# EAGLE design control (EAGLE 9.6.2)
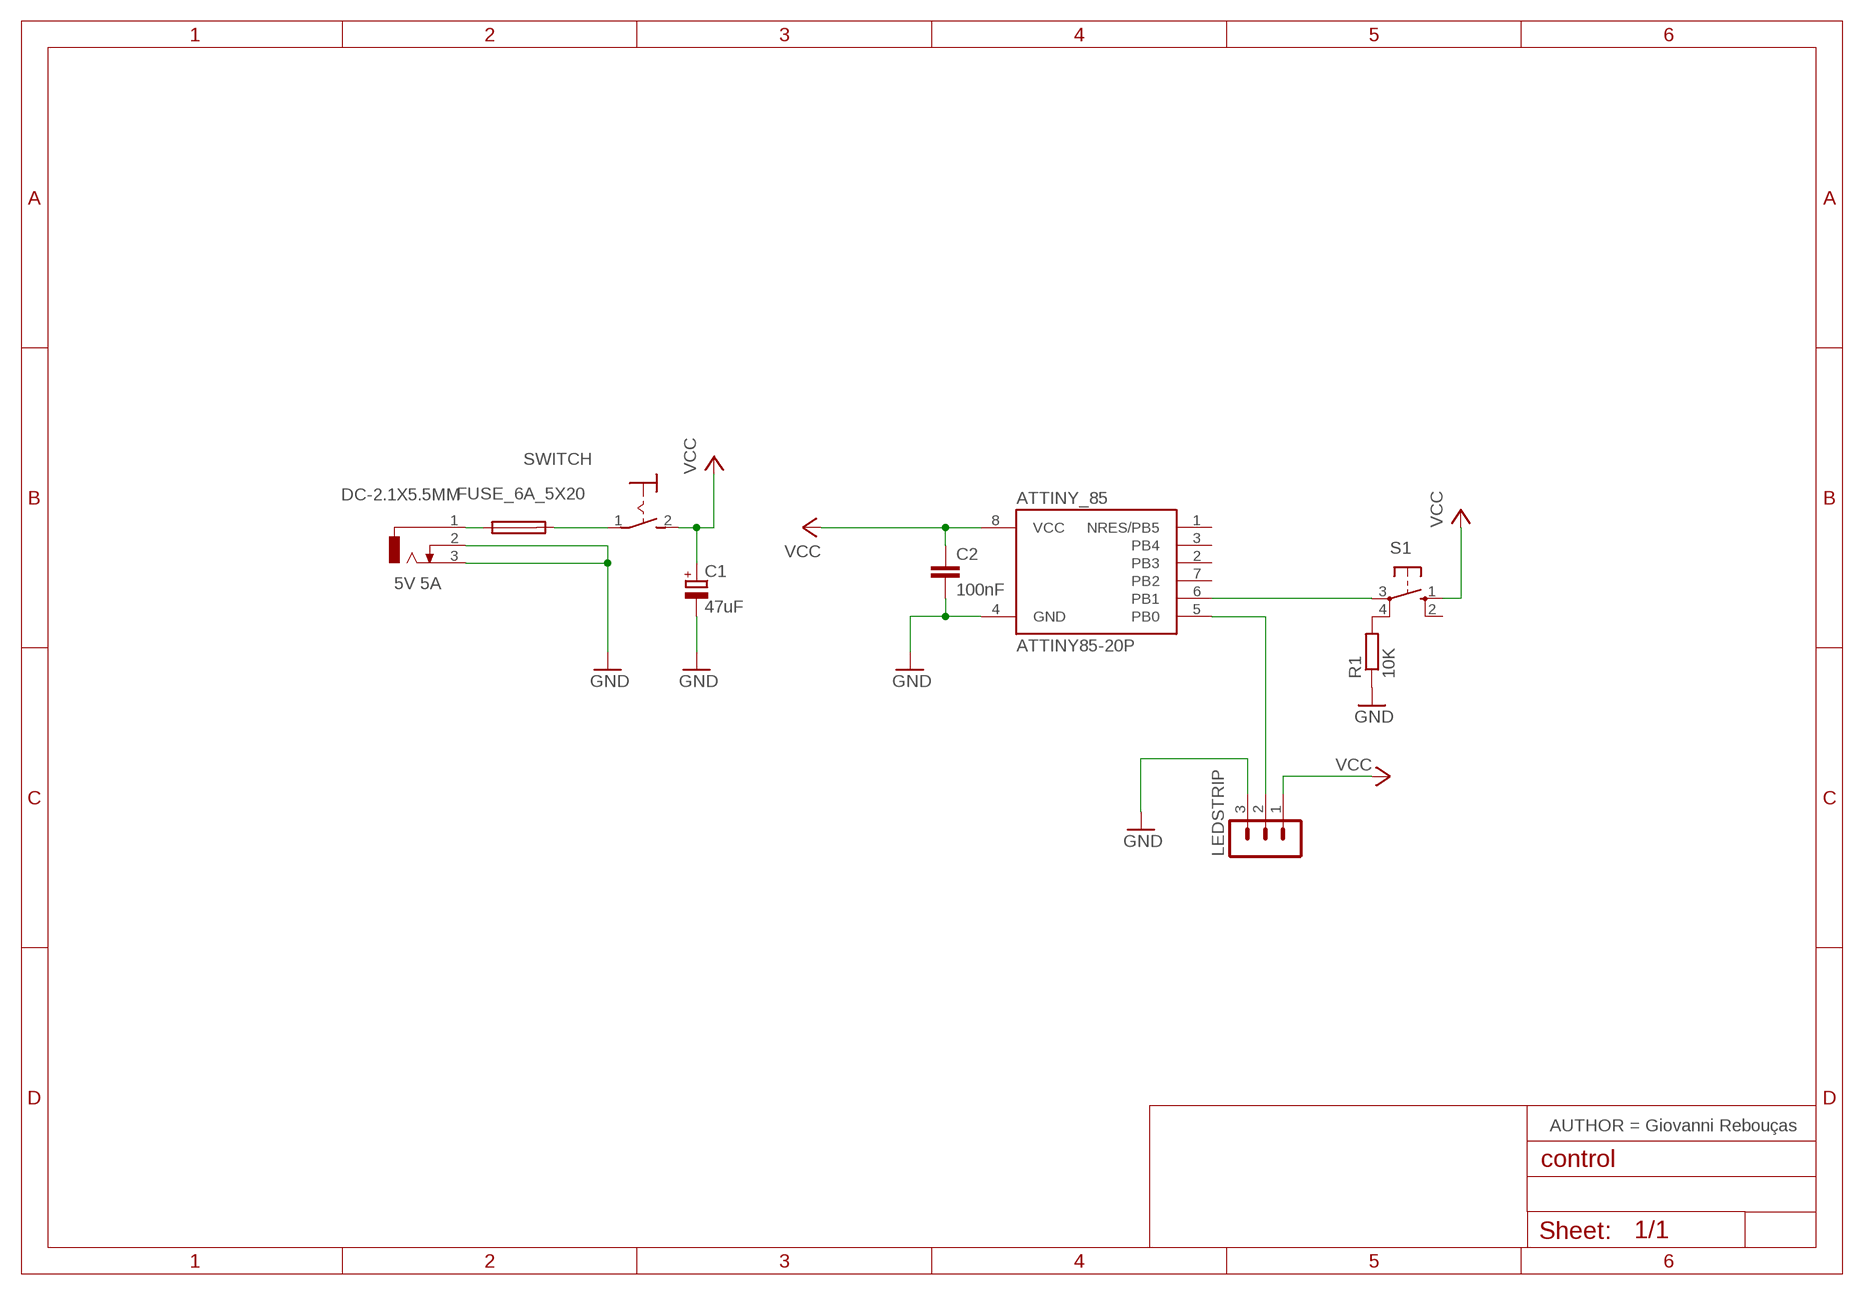
[diagram p0: schematic, sheet 1]
FRAME1 (A4L-LOC): AUTHOR: Giovanni Rebouças

## Parts
ATTINY_85  ATTINY85-20P  [PDIP08_300MIL]
C1  47uF  CPOL-EUE3.5-10  [E3,5-10]
C2  100nF  C-EU025-025X050  [C025-025X050]
DC-2.1X5.5MM  5V 5A  DCJ0303  [DCJ0303]
FUSE_6A_5X20  FUSEBLANK_5X20MM  [FUSE_HOLDER_5X20MM]
LEDSTRIP  MA03-1  [MA03-1]
R1  10K  R-EU_0207/10  [0207/10]
S1  10-XX  [B3F-10XX]
SWITCH  MS243  [MS243]

## Nets
DATAIN: ATTINY_85.5(PB0) LEDSTRIP.2
GND: ATTINY_85.4(GND) C1.- C2.2 DC-2.1X5.5MM.2 DC-2.1X5.5MM.3 LEDSTRIP.3 R1.1
N$3: R1.2 S1.4(P1)
N$4: DC-2.1X5.5MM.1 FUSE_6A_5X20.1
N$5: FUSE_6A_5X20.2 SWITCH.1(P)
SWITCHIN: ATTINY_85.6(PB1) S1.3(P)
VCC: ATTINY_85.8(VCC) C1.+ C2.1 LEDSTRIP.1 S1.1(S) SWITCH.2(S)
Unconnected: ATTINY_85.1(NRES/PB5) ATTINY_85.2(PB3) ATTINY_85.3(PB4) ATTINY_85.7(PB2) S1.2(S1)

## Library data of the parts
ATTINY_85 = _hhn_attiny25_45_85:ATTINY85*: ATMEL ATtiny 85 Packages: P = PDIP 08 30mil S = SOIC 08 EIAJ 208mil Technologies Note: for complete ordering code (temp. range, finish, tape&reel etc.) see www.atmel.com • Supply Voltage: V = (1.8…5.5)V | [blank] = (2.7…5.5)V • Speed: 10 = 10 MHz | 20 = 20 MHz Author: Dipl.-Ing. FH Rainer Bayer HHN Hochschule Heilbronn (Heilbronn University), rainer.bayer@hs-heilbronn.de Ingenieurbüro ing-rb, mail@ing-rb.de
C1 = rcl:CPOL-EU: POLARIZED CAPACITOR, European symbol; SPICEPREFIX: C
C2 = rcl:C-EU: CAPACITOR, European symbol; SPICEPREFIX: C
DC-2.1X5.5MM = con-jack:DCJ0303: DC POWER JACK Source: DCJ0303.pdf; OC_FARNELL: unknown; OC_NEWARK: unknown
FUSE_6A_5X20 = fuse:FUSE: Fuse; OC_FARNELL: unknown; OC_NEWARK: unknown
LEDSTRIP = con-lstb:MA03-1: PIN HEADER; OC_FARNELL: unknown; OC_NEWARK: unknown
R1 = rcl:R-EU_: RESISTOR, European symbol; SPICEPREFIX: R
S1 = switch-omron:10-XX: OMRON SWITCH; MPN: B3F-1000; OC_FARNELL: 176432; OC_NEWARK: 36M3542
SWITCH = fixed-switch:MS243: TOGGLE SWITCH

## Board
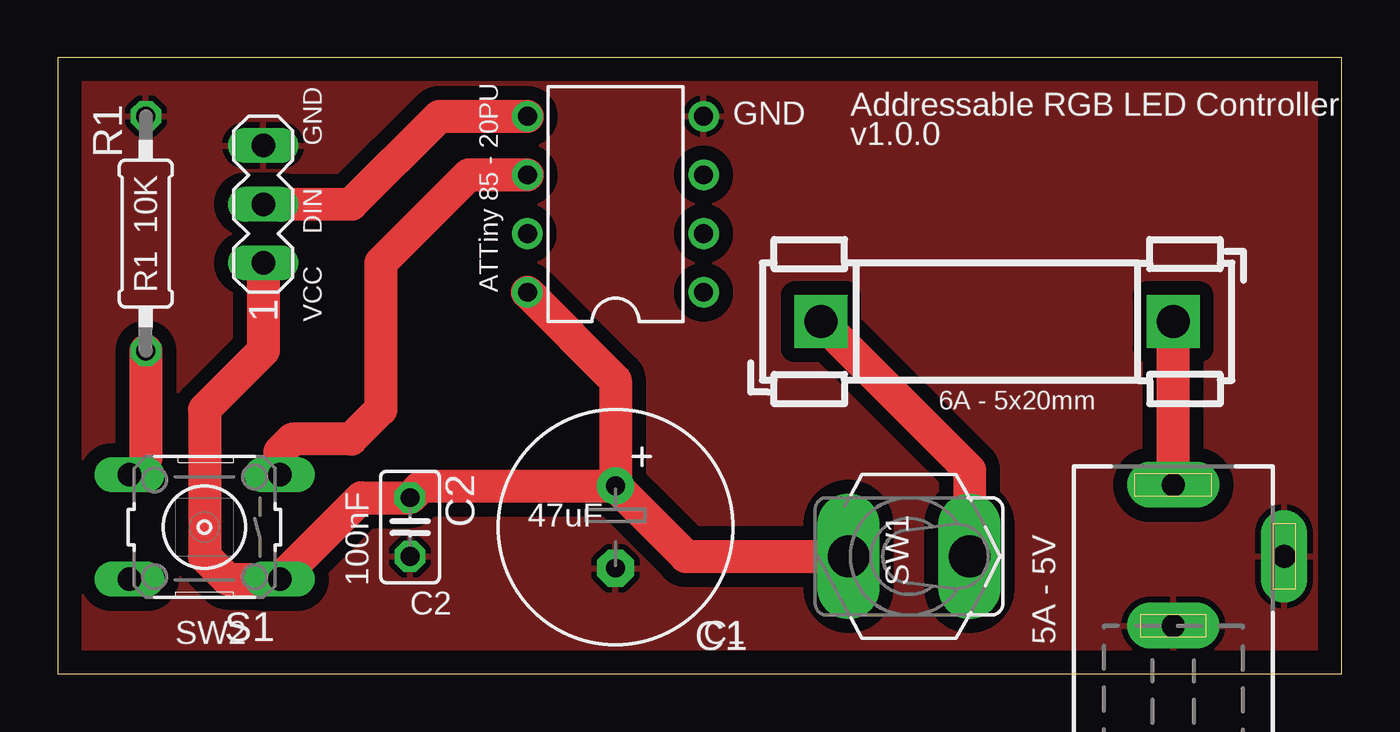
[diagram p1: board, top side]

Size 55.55 x 26.66 mm. Coordinates in mm from the lower left corner, seen from the top.
Outline: 0,0 55.55,0 55.55,26.66 0,26.66 0,0
Copper layers (1*16): Top 0.035mm / dielectric 1.5mm / Bottom 0.035mm
Design rules "default *": minimum track width 6mil, minimum drill 0.35mm, track to track 24mil, track to pad 24mil, pad to pad 24mil, via to via 24mil, smd to smd 6mil, copper to edge 40mil, drill to drill 6mil, minimum pad ring 10mil, minimum via ring 8mil, stop-mask expansion 4mil, vias tented up to drill 0mil, thermal gap 10mil

### Footprints (pad centres in the part's own frame; a part is rotated, then mirrored left to right if it is on the bottom)
PDIP08_300MIL = drill 0.813: 1 -3.81,-3.81; 2 -1.27,-3.81; 3 1.27,-3.81; 4 3.81,-3.81; 5 3.81,3.81; 6 1.27,3.81; 7 -1.27,3.81; 8 -3.81,3.81
E3,5-10 = drill 0.813 pad 1.6: + -1.778,0 | drill 0.813 pad 1.6 octagon: - 1.778,0
C025-025X050 = drill 0.813 octagon: 1 -1.27,0; 2 1.27,0
DCJ0303 = drill 1 pad 2 long: 1 0,3.1; 2 4.8,0; 3 0,-3
FUSE_HOLDER_5X20MM = drill 1.422 pad 2.286 square: 1 0,0; 2 15.24,0
MA03-1 = drill 1.016 long: 1 -2.54,0; 2 0,0; 3 2.54,0
0207/10 = drill 0.813 octagon: 1 -5.08,0; 2 5.08,0
B3F-10XX = drill 1.016 long: 1 -3.251,2.261; 2 3.251,2.261; 3 -3.251,-2.261; 4 3.251,-2.261
MS243 = drill 1.803 pad 2 long: 1 0,-3.886; 2 0,1.346

### Placement (x,y rotation side)
ATTINY_85  24.13,20.32 90 top
C1  24.13,6.35 270 top
C2  15.24,6.35 270 top
DC-2.1X5.5MM  48.26,5.08 0 top
FUSE_6A_5X20  48.26,15.24 180 top
LEDSTRIP  8.89,20.32 90 top
R1  3.81,19.05 270 top
S1  6.35,6.35 180 top
SWITCH  35.56,5.08 90 top

### Tracks (layer width: path | path; a pad name or v marks a point on that pad's centre or on a via)
DATAIN
  Top 1.418: LEDSTRIP.2 12.7,20.32 16.51,24.13 ATTINY_85.5
GND
  pour Top: 0,0 0,26.67 55.88,26.67 55.88,0
N$3
  Top 0.152: 3.81,9.32 S1.4
  Top 1.418: R1.2 3.81,9.32
N$4
  Top 1.418: DC-2.1X5.5MM.1 48.26,11.43 FUSE_6A_5X20.1
N$5
  Top 1.418: FUSE_6A_5X20.2 39.45,8.81 SWITCH.1
SWITCHIN
  Top 1.418: ATTINY_85.6 17.78,21.59 13.97,17.78 13.97,11.43 12.7,10.16 10.16,10.16 9.6,9.6 S1.3
VCC
  Top 1.418: LEDSTRIP.1 8.89,13.97 6.35,11.43 6.35,5.08 7.34,4.09 S1.1 13.13,7.62 C2.1 15.75,8.13 C1.+ | ATTINY_85.8 24.13,12.7 C1.+ | C1.+ 27.18,5.08 SWITCH.2

### Text on the board
tPlace: GND | Addressable RGB LED Controller | GND | v1.0.0 | 10K | DIN | R1 | ATTiny 85 - 20PU | VCC | 6A - 5x20mm | 47uF | 100nF | SW1 | C2 | SW2 | C1 | 5A - 5V